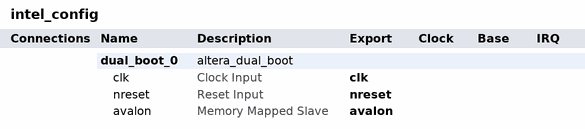
[diagram p0: system contents]
# Platform Designer (Qsys) system intel_config, MAX 10 10M08SCE144C8G
# Parameters at their usual value, and those the tool derives, are not listed.
package require -exact qsys 20.1
create_system intel_config
set_project_property DEVICE_FAMILY {MAX 10}
set_project_property DEVICE 10M08SCE144C8G

add_instance dual_boot_0 altera_dual_boot 20.1
set_instance_property dual_boot_0 AUTO_EXPORT true
set_instance_parameter_value dual_boot_0 CLOCK_FREQUENCY 50.0

# exported interfaces
add_interface avalon avalon slave
set_interface_property avalon EXPORT_OF dual_boot_0.avalon
add_interface clk clock sink
set_interface_property clk EXPORT_OF dual_boot_0.clk
add_interface nreset reset sink
set_interface_property nreset EXPORT_OF dual_boot_0.nreset

set_interconnect_requirement {$system} qsys_mm.clockCrossingAdapter HANDSHAKE
set_interconnect_requirement {$system} qsys_mm.enableEccProtection FALSE
set_interconnect_requirement {$system} qsys_mm.insertDefaultSlave FALSE
set_interconnect_requirement {$system} qsys_mm.maxAdditionalLatency 1

save_system intel_config.qsys
